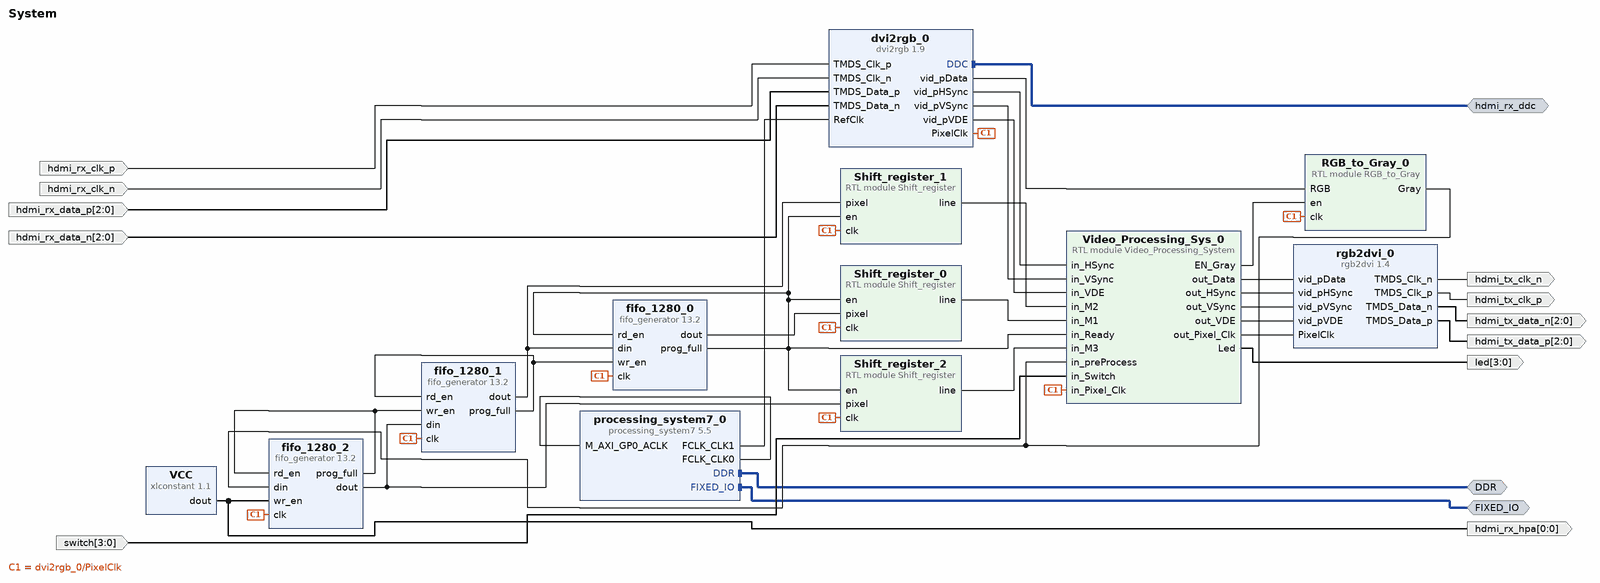
[diagram p0: block diagram of the top level]
# Vivado block design System, xc7z020clg400-1, Vivado 2018.2
create_bd_design System

create_bd_intf_port -mode Master -vlnv xilinx.com:interface:iic_rtl:1.0 hdmi_rx_ddc
create_bd_intf_port -mode Master -vlnv xilinx.com:interface:ddrx_rtl:1.0 DDR
create_bd_intf_port -mode Master -vlnv xilinx.com:display_processing_system7:fixedio_rtl:1.0 FIXED_IO
create_bd_port -dir I -type clk hdmi_rx_clk_p
create_bd_port -dir I -type clk hdmi_rx_clk_n
create_bd_port -dir I -from 2 -to 0 hdmi_rx_data_p
create_bd_port -dir I -from 2 -to 0 hdmi_rx_data_n
create_bd_port -dir O -type clk hdmi_tx_clk_p
create_bd_port -dir O -type clk hdmi_tx_clk_n
create_bd_port -dir O -from 2 -to 0 hdmi_tx_data_p
create_bd_port -dir O -from 2 -to 0 hdmi_tx_data_n
create_bd_port -dir I -from 3 -to 0 switch
create_bd_port -dir O -from 3 -to 0 led
create_bd_port -dir O -from 0 -to 0 hdmi_rx_hpa

create_bd_cell -type ip -vlnv xilinx.com:ip:xlconstant:1.1 VCC
create_bd_cell -type ip -vlnv digilentinc.com:ip:rgb2dvi:1.4 rgb2dvi_0
set_property -dict {CONFIG.kClkPrimitive PLL CONFIG.kGenerateSerialClk true CONFIG.kClkRange 3} [get_bd_cells rgb2dvi_0]
create_bd_cell -type ip -vlnv xilinx.com:ip:processing_system7:5.5 processing_system7_0
set_property -dict [list \
  CONFIG.PCW_FCLK_CLK1_BUF TRUE \
  CONFIG.PCW_UIPARAM_DDR_FREQ_MHZ 533.333333 \
  CONFIG.PCW_APU_PERIPHERAL_FREQMHZ 667 \
  CONFIG.PCW_SDIO_PERIPHERAL_FREQMHZ 50 \
  CONFIG.PCW_UART_PERIPHERAL_FREQMHZ 100 \
  CONFIG.PCW_FPGA0_PERIPHERAL_FREQMHZ 100 \
  CONFIG.PCW_FPGA1_PERIPHERAL_FREQMHZ 200 \
  CONFIG.PCW_EN_CLK1_PORT 1 \
  CONFIG.PCW_PRESET_BANK1_VOLTAGE {LVCMOS 1.8V} \
  CONFIG.PCW_UIPARAM_DDR_MEMORY_TYPE {DDR 3 (Low Voltage)} \
  CONFIG.PCW_UIPARAM_DDR_PARTNO {MT41K256M16 RE-125} \
  CONFIG.PCW_QSPI_PERIPHERAL_ENABLE 1 \
  CONFIG.PCW_QSPI_QSPI_IO {MIO 1 .. 6} \
  CONFIG.PCW_QSPI_GRP_SINGLE_SS_ENABLE 1 \
  CONFIG.PCW_QSPI_GRP_SINGLE_SS_IO {MIO 1 .. 6} \
  CONFIG.PCW_SINGLE_QSPI_DATA_MODE x4 \
  CONFIG.PCW_QSPI_GRP_FBCLK_ENABLE 1 \
  CONFIG.PCW_QSPI_GRP_FBCLK_IO {MIO 8} \
  CONFIG.PCW_ENET0_PERIPHERAL_ENABLE 1 \
  CONFIG.PCW_ENET0_ENET0_IO {MIO 16 .. 27} \
  CONFIG.PCW_ENET0_GRP_MDIO_ENABLE 1 \
  CONFIG.PCW_ENET0_GRP_MDIO_IO {MIO 52 .. 53} \
  CONFIG.PCW_ENET_RESET_ENABLE 1 \
  CONFIG.PCW_ENET_RESET_SELECT {Share reset pin} \
  CONFIG.PCW_ENET0_RESET_ENABLE 0 \
  CONFIG.PCW_SD0_PERIPHERAL_ENABLE 1 \
  CONFIG.PCW_SD0_SD0_IO {MIO 40 .. 45} \
  CONFIG.PCW_SD0_GRP_CD_ENABLE 1 \
  CONFIG.PCW_SD0_GRP_CD_IO {MIO 47} \
  CONFIG.PCW_SD0_GRP_WP_ENABLE 0 \
  CONFIG.PCW_UART1_PERIPHERAL_ENABLE 1 \
  CONFIG.PCW_UART1_UART1_IO {MIO 48 .. 49} \
  CONFIG.PCW_USB0_PERIPHERAL_ENABLE 1 \
  CONFIG.PCW_USB0_USB0_IO {MIO 28 .. 39} \
  CONFIG.PCW_USB_RESET_ENABLE 1 \
  CONFIG.PCW_USB_RESET_SELECT {Share reset pin} \
  CONFIG.PCW_USB0_RESET_ENABLE 1 \
  CONFIG.PCW_USB0_RESET_IO {MIO 46} \
  CONFIG.PCW_I2C_RESET_ENABLE 0 \
  CONFIG.PCW_GPIO_MIO_GPIO_ENABLE 1 \
  CONFIG.PCW_GPIO_MIO_GPIO_IO MIO \
  CONFIG.PCW_FPGA_FCLK1_ENABLE 1 \
] [get_bd_cells processing_system7_0]
# 295 more settings of processing_system7_0 are not shown: defaults, MIO pin electricals, DDR timing, and values the tool derives
create_bd_cell -type ip -vlnv xilinx.com:ip:fifo_generator:13.2 fifo_1280_0
set_property -dict [list \
  CONFIG.Input_Data_Width 24 \
  CONFIG.Input_Depth 4096 \
  CONFIG.Output_Data_Width 24 \
  CONFIG.Reset_Pin false \
  CONFIG.Programmable_Full_Type Single_Programmable_Full_Threshold_Constant \
  CONFIG.Full_Threshold_Assert_Value 824 \
  CONFIG.Programmable_Empty_Type No_Programmable_Empty_Threshold \
] [get_bd_cells fifo_1280_0]
create_bd_cell -type ip -vlnv xilinx.com:ip:fifo_generator:13.2 fifo_1280_1
set_property -dict [list \
  CONFIG.Input_Data_Width 24 \
  CONFIG.Input_Depth 4096 \
  CONFIG.Output_Data_Width 24 \
  CONFIG.Reset_Pin false \
  CONFIG.Programmable_Full_Type Single_Programmable_Full_Threshold_Constant \
  CONFIG.Full_Threshold_Assert_Value 824 \
  CONFIG.Programmable_Empty_Type No_Programmable_Empty_Threshold \
] [get_bd_cells fifo_1280_1]
create_bd_cell -type ip -vlnv xilinx.com:ip:fifo_generator:13.2 fifo_1280_2
set_property -dict [list \
  CONFIG.Input_Data_Width 24 \
  CONFIG.Input_Depth 4096 \
  CONFIG.Output_Data_Width 24 \
  CONFIG.Reset_Pin false \
  CONFIG.Programmable_Full_Type Single_Programmable_Full_Threshold_Constant \
  CONFIG.Full_Threshold_Assert_Value 824 \
  CONFIG.Programmable_Empty_Type No_Programmable_Empty_Threshold \
] [get_bd_cells fifo_1280_2]
create_bd_cell -type ip -vlnv digilentinc.com:ip:dvi2rgb:1.9 dvi2rgb_0
set_property -dict [list \
  CONFIG.kEnableSerialClkOutput false \
  CONFIG.kRstActiveHigh true \
  CONFIG.kClkRange 3 \
  CONFIG.kDebug false \
] [get_bd_cells dvi2rgb_0]
create_bd_cell -type module -reference RGB_to_Gray RGB_to_Gray_0
create_bd_cell -type module -reference Shift_register Shift_register_0
create_bd_cell -type module -reference Shift_register Shift_register_1
create_bd_cell -type module -reference Shift_register Shift_register_2
create_bd_cell -type module -reference Video_Processing_System Video_Processing_Sys_0

# ---- connections ----

connect_bd_intf_net [get_bd_intf_ports hdmi_rx_ddc] [get_bd_intf_pins dvi2rgb_0/DDC]
connect_bd_intf_net [get_bd_intf_ports DDR] [get_bd_intf_pins processing_system7_0/DDR]
connect_bd_intf_net [get_bd_intf_ports FIXED_IO] [get_bd_intf_pins processing_system7_0/FIXED_IO]
connect_bd_net [get_bd_ports hdmi_rx_clk_p] [get_bd_pins dvi2rgb_0/TMDS_Clk_p]
connect_bd_net [get_bd_ports hdmi_rx_clk_n] [get_bd_pins dvi2rgb_0/TMDS_Clk_n]
connect_bd_net [get_bd_ports hdmi_rx_data_p] [get_bd_pins dvi2rgb_0/TMDS_Data_p]
connect_bd_net [get_bd_ports hdmi_rx_data_n] [get_bd_pins dvi2rgb_0/TMDS_Data_n]
connect_bd_net [get_bd_pins rgb2dvi_0/TMDS_Clk_p] [get_bd_ports hdmi_tx_clk_p]
connect_bd_net [get_bd_pins rgb2dvi_0/TMDS_Clk_n] [get_bd_ports hdmi_tx_clk_n]
connect_bd_net [get_bd_pins rgb2dvi_0/TMDS_Data_p] [get_bd_ports hdmi_tx_data_p]
connect_bd_net [get_bd_pins rgb2dvi_0/TMDS_Data_n] [get_bd_ports hdmi_tx_data_n]
connect_bd_net [get_bd_pins processing_system7_0/FCLK_CLK0] [get_bd_pins processing_system7_0/M_AXI_GP0_ACLK]
connect_bd_net [get_bd_pins processing_system7_0/FCLK_CLK1] [get_bd_pins dvi2rgb_0/RefClk]
connect_bd_net [get_bd_pins dvi2rgb_0/vid_pHSync] [get_bd_pins Video_Processing_Sys_0/in_HSync]
connect_bd_net [get_bd_pins dvi2rgb_0/vid_pVSync] [get_bd_pins Video_Processing_Sys_0/in_VSync]
connect_bd_net [get_bd_pins dvi2rgb_0/vid_pVDE] [get_bd_pins Video_Processing_Sys_0/in_VDE]
connect_bd_net [get_bd_ports switch] [get_bd_pins Video_Processing_Sys_0/in_Switch]
connect_bd_net [get_bd_pins Video_Processing_Sys_0/out_Data] [get_bd_pins rgb2dvi_0/vid_pData]
connect_bd_net [get_bd_pins Video_Processing_Sys_0/out_HSync] [get_bd_pins rgb2dvi_0/vid_pHSync]
connect_bd_net [get_bd_pins Video_Processing_Sys_0/out_VSync] [get_bd_pins rgb2dvi_0/vid_pVSync]
connect_bd_net [get_bd_pins Video_Processing_Sys_0/out_VDE] [get_bd_pins rgb2dvi_0/vid_pVDE]
connect_bd_net [get_bd_pins Video_Processing_Sys_0/out_Pixel_Clk] [get_bd_pins rgb2dvi_0/PixelClk]
connect_bd_net [get_bd_pins dvi2rgb_0/vid_pData] [get_bd_pins RGB_to_Gray_0/RGB]
connect_bd_net [get_bd_pins Video_Processing_Sys_0/Led] [get_bd_ports led]
connect_bd_net [get_bd_pins Video_Processing_Sys_0/EN_Gray] [get_bd_pins RGB_to_Gray_0/en]
connect_bd_net [get_bd_pins dvi2rgb_0/PixelClk] \
  [get_bd_pins RGB_to_Gray_0/clk] [get_bd_pins fifo_1280_0/clk] [get_bd_pins fifo_1280_1/clk] [get_bd_pins fifo_1280_2/clk] \
  [get_bd_pins Shift_register_0/clk] [get_bd_pins Shift_register_1/clk] [get_bd_pins Shift_register_2/clk] \
  [get_bd_pins Video_Processing_Sys_0/in_Pixel_Clk]
connect_bd_net [get_bd_pins VCC/dout] [get_bd_ports hdmi_rx_hpa] [get_bd_pins fifo_1280_2/wr_en]
connect_bd_net [get_bd_pins RGB_to_Gray_0/Gray] [get_bd_pins fifo_1280_2/din] [get_bd_pins Video_Processing_Sys_0/in_preProcess]
connect_bd_net -net fifo_1280_2_full [get_bd_pins fifo_1280_2/prog_full] [get_bd_pins fifo_1280_2/rd_en] [get_bd_pins fifo_1280_1/wr_en]
connect_bd_net [get_bd_pins fifo_1280_2/dout] [get_bd_pins fifo_1280_1/din] [get_bd_pins Shift_register_2/pixel]
connect_bd_net -net fifo_1280_1_full [get_bd_pins fifo_1280_1/prog_full] [get_bd_pins fifo_1280_0/wr_en] [get_bd_pins fifo_1280_1/rd_en]
connect_bd_net [get_bd_pins fifo_1280_1/dout] [get_bd_pins fifo_1280_0/din] [get_bd_pins Shift_register_1/pixel]
connect_bd_net -net fifo_1280_0_full [get_bd_pins fifo_1280_0/prog_full] \
  [get_bd_pins fifo_1280_0/rd_en] [get_bd_pins Shift_register_0/en] [get_bd_pins Shift_register_1/en] \
  [get_bd_pins Shift_register_2/en] [get_bd_pins Video_Processing_Sys_0/in_Ready]
connect_bd_net [get_bd_pins fifo_1280_0/dout] [get_bd_pins Shift_register_0/pixel]
connect_bd_net [get_bd_pins Shift_register_0/line] [get_bd_pins Video_Processing_Sys_0/in_M1]
connect_bd_net [get_bd_pins Shift_register_1/line] [get_bd_pins Video_Processing_Sys_0/in_M2]
connect_bd_net [get_bd_pins Shift_register_2/line] [get_bd_pins Video_Processing_Sys_0/in_M3]

validate_bd_design
save_bd_design
